# EAGLE design H01 (EAGLE 6.6.0)

## Sheet 1 of 3
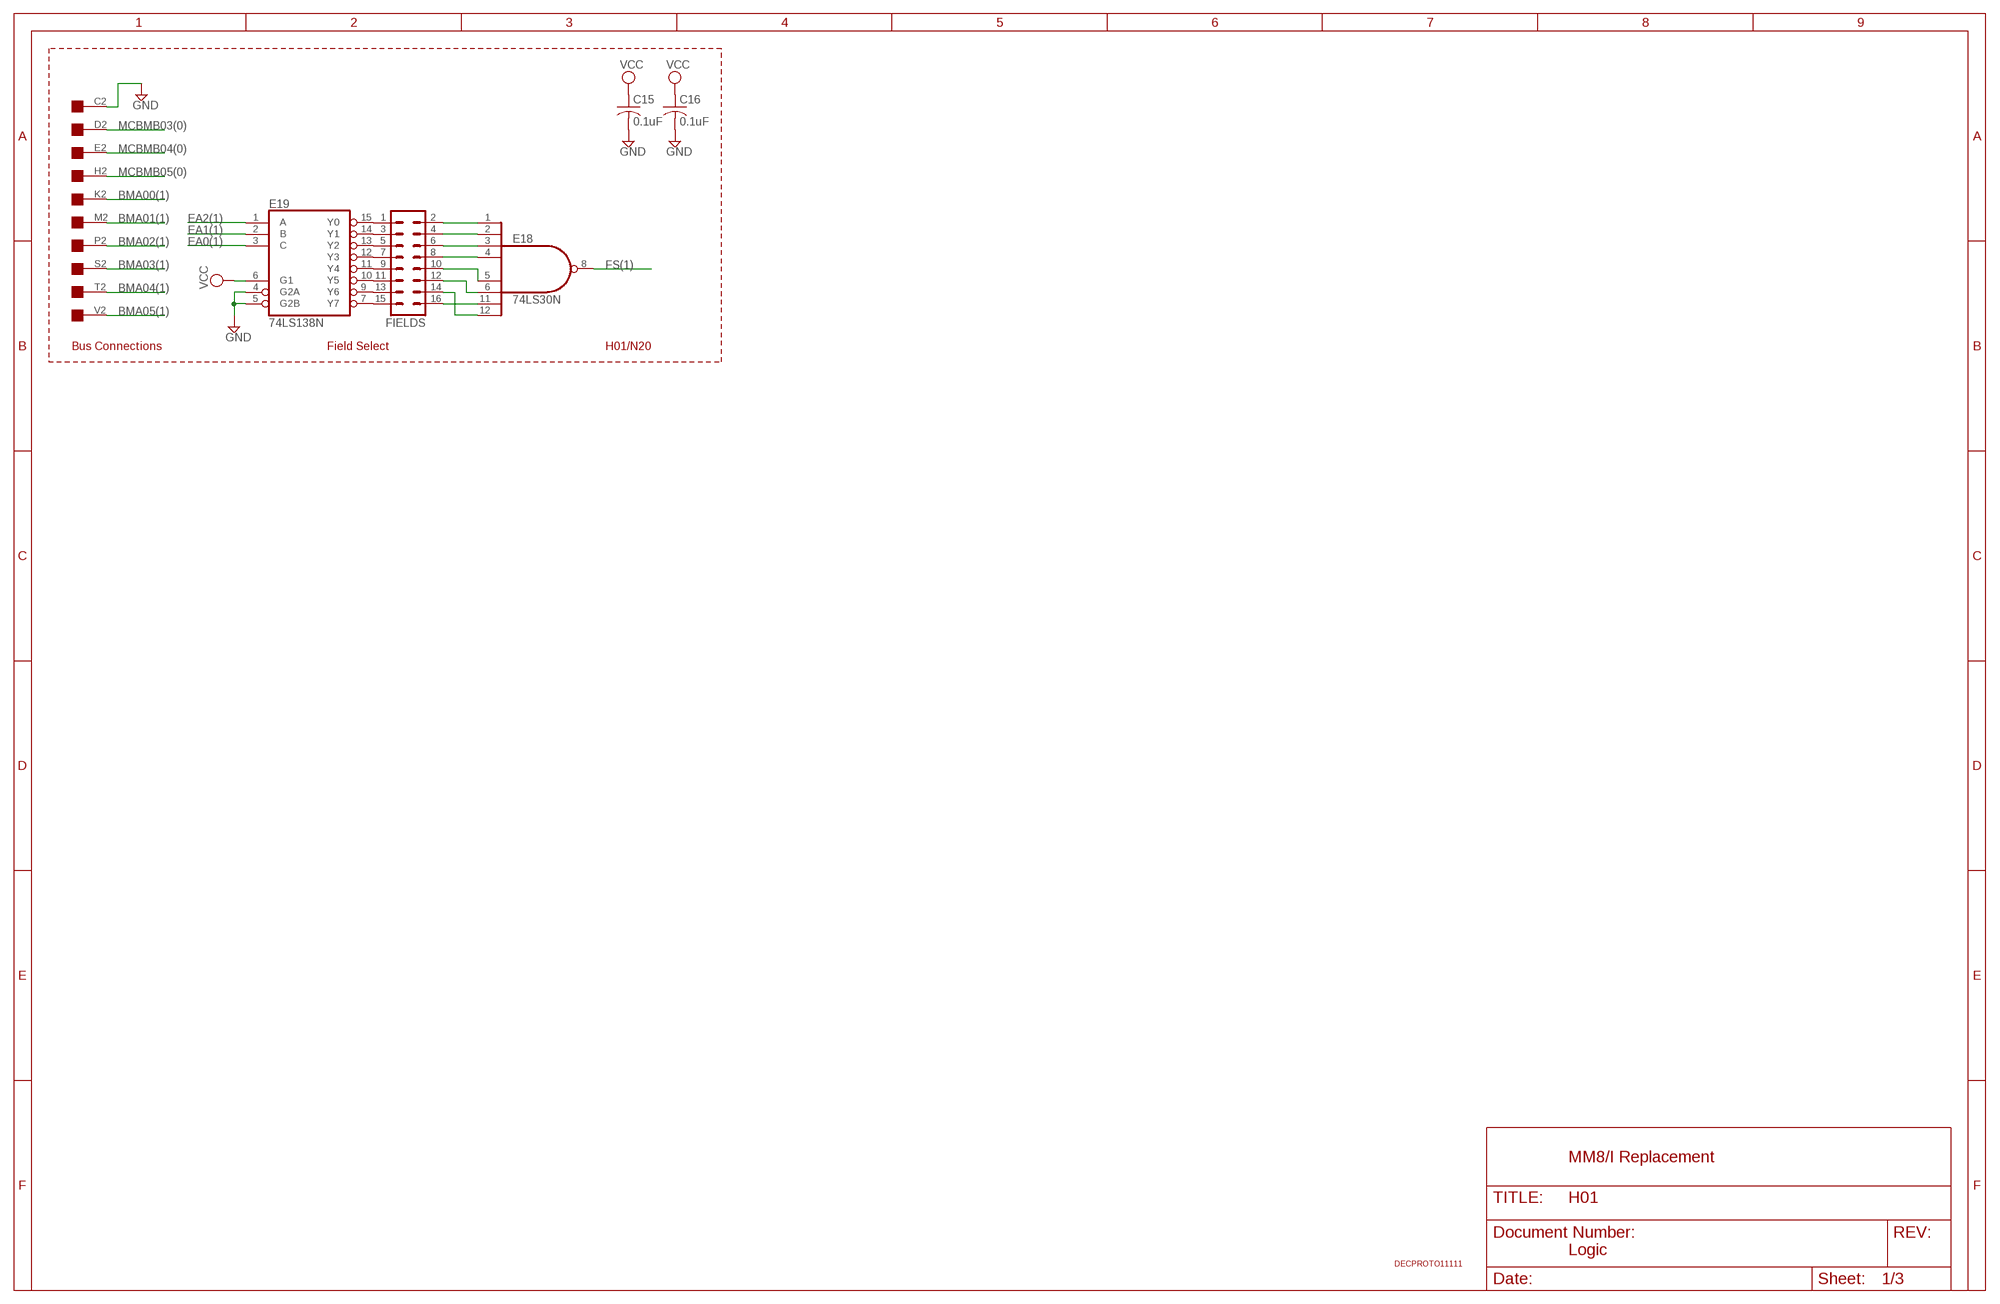
[diagram p0: schematic, sheet 1]

### Parts
C15  0.1uF  C-US050-025X075  [C050-025X075]
C16  0.1uF  C-US050-025X075  [C050-025X075]
E18  74LS30N  [DIL14]
E19  74LS138N  [DIL16]
FIELDS  MA08-2  [MA08-2]
H01  EDGE-1  [EDGE-CON1]
U$6  DECPROTO11111  [DECPROTO11111]

### Nets
BMA00(1): H01.K2 ; also sheet 2
BMA01(1): H01.M2 ; also sheet 2
BMA02(1): H01.P2 ; also sheet 2
BMA03(1): H01.S2 ; also sheet 2
BMA04(1): H01.T2 ; also sheet 2
BMA05(1): H01.V2 ; also sheet 2
EA0(1): E19.3(C) ; also sheet 2
EA1(1): E19.2(B) ; also sheet 2
EA2(1): E19.1(A) ; also sheet 2
FS(1): E18.8(O) ; also sheet 2
GND [supply]: C15.2 C16.2 E19.4(G2A) E19.5(G2B) H01.C2 ; also sheet 2
MCBMB03(0): H01.D2 ; also sheet 2
MCBMB04(0): H01.E2 ; also sheet 2
MCBMB05(0): H01.H2 ; also sheet 2
N$18: E19.15(Y0) FIELDS.1
N$19: E19.14(Y1) FIELDS.3
N$20: E19.13(Y2) FIELDS.5
N$21: E19.12(Y3) FIELDS.7
N$22: E19.11(Y4) FIELDS.9
N$23: E19.10(Y5) FIELDS.11
N$24: E19.9(Y6) FIELDS.13
N$25: E19.7(Y7) FIELDS.15
N$26: E18.4(I3) FIELDS.8
N$27: E18.3(I2) FIELDS.6
N$28: E18.2(I1) FIELDS.4
N$29: E18.1(I0) FIELDS.2
N$30: E18.5(I4) FIELDS.10
N$31: E18.6(I5) FIELDS.12
N$32: E18.12(I7) FIELDS.14
N$33: E18.11(I6) FIELDS.16
VCC [supply]: C15.1 C16.1 E19.6(G1) ; also sheet 2
Unconnected: H01.A2 H01.B2 H01.F2 H01.J2 H01.L2 H01.N2 H01.R2 H01.U2

### Notes on the sheet
- Bus Connections | Field Select | H01/N20
- MM8/I Replacement
- Logic

## Sheet 2 of 3
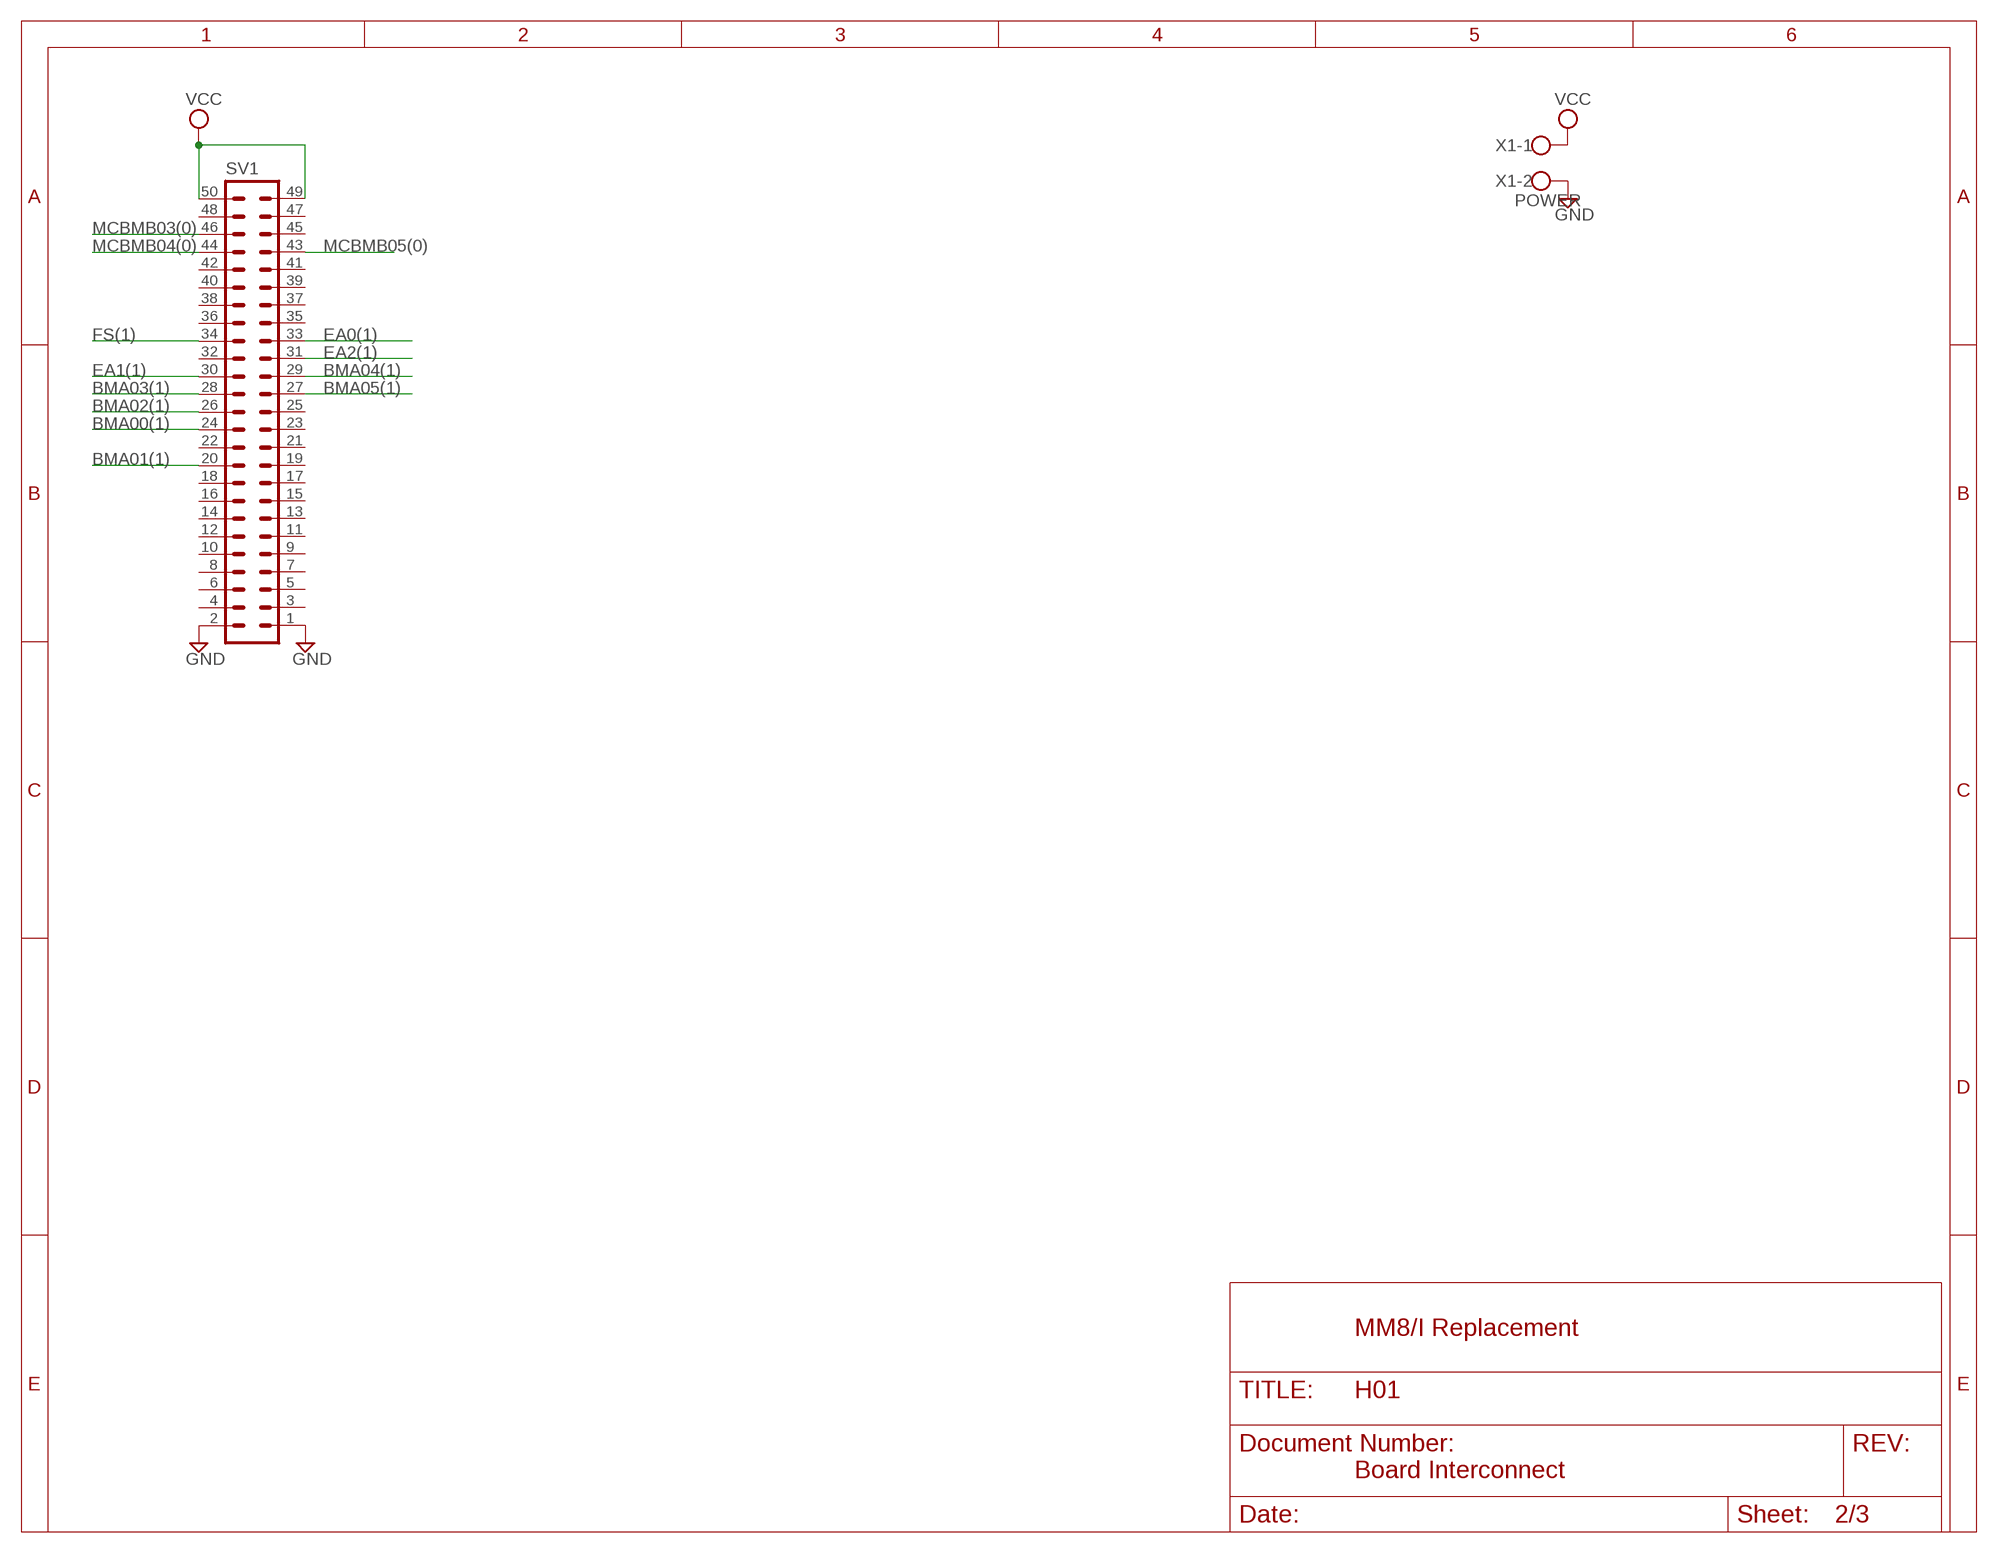
[diagram p1: schematic, sheet 2]

### Parts
SV1  ML50L  [ML50L]
X1  POWER  W237-102  [W237-102]

### Nets
BMA00(1): SV1.24 ; also sheet 1
BMA01(1): SV1.20 ; also sheet 1
BMA02(1): SV1.26 ; also sheet 1
BMA03(1): SV1.28 ; also sheet 1
BMA04(1): SV1.29 ; also sheet 1
BMA05(1): SV1.27 ; also sheet 1
EA0(1): SV1.33 ; also sheet 1
EA1(1): SV1.30 ; also sheet 1
EA2(1): SV1.31 ; also sheet 1
FS(1): SV1.34 ; also sheet 1
GND [supply]: SV1.1 SV1.2 X1.2 ; also sheet 1
MCBMB03(0): SV1.46 ; also sheet 1
MCBMB04(0): SV1.44 ; also sheet 1
MCBMB05(0): SV1.43 ; also sheet 1
VCC [supply]: SV1.49 SV1.50 X1.1 ; also sheet 1
Unconnected: SV1.3 SV1.4 SV1.5 SV1.6 SV1.7 SV1.8 SV1.9 SV1.10 SV1.11 SV1.12 SV1.13 SV1.14 SV1.15 SV1.16 SV1.17 SV1.18 SV1.19 SV1.21 SV1.22 SV1.23 SV1.25 SV1.32 SV1.35 SV1.36 SV1.37 SV1.38 SV1.39 SV1.40 SV1.41 SV1.42 SV1.45 SV1.47 SV1.48

### Notes on the sheet
- MM8/I Replacement
- Board Interconnect

## Sheet 3 of 3
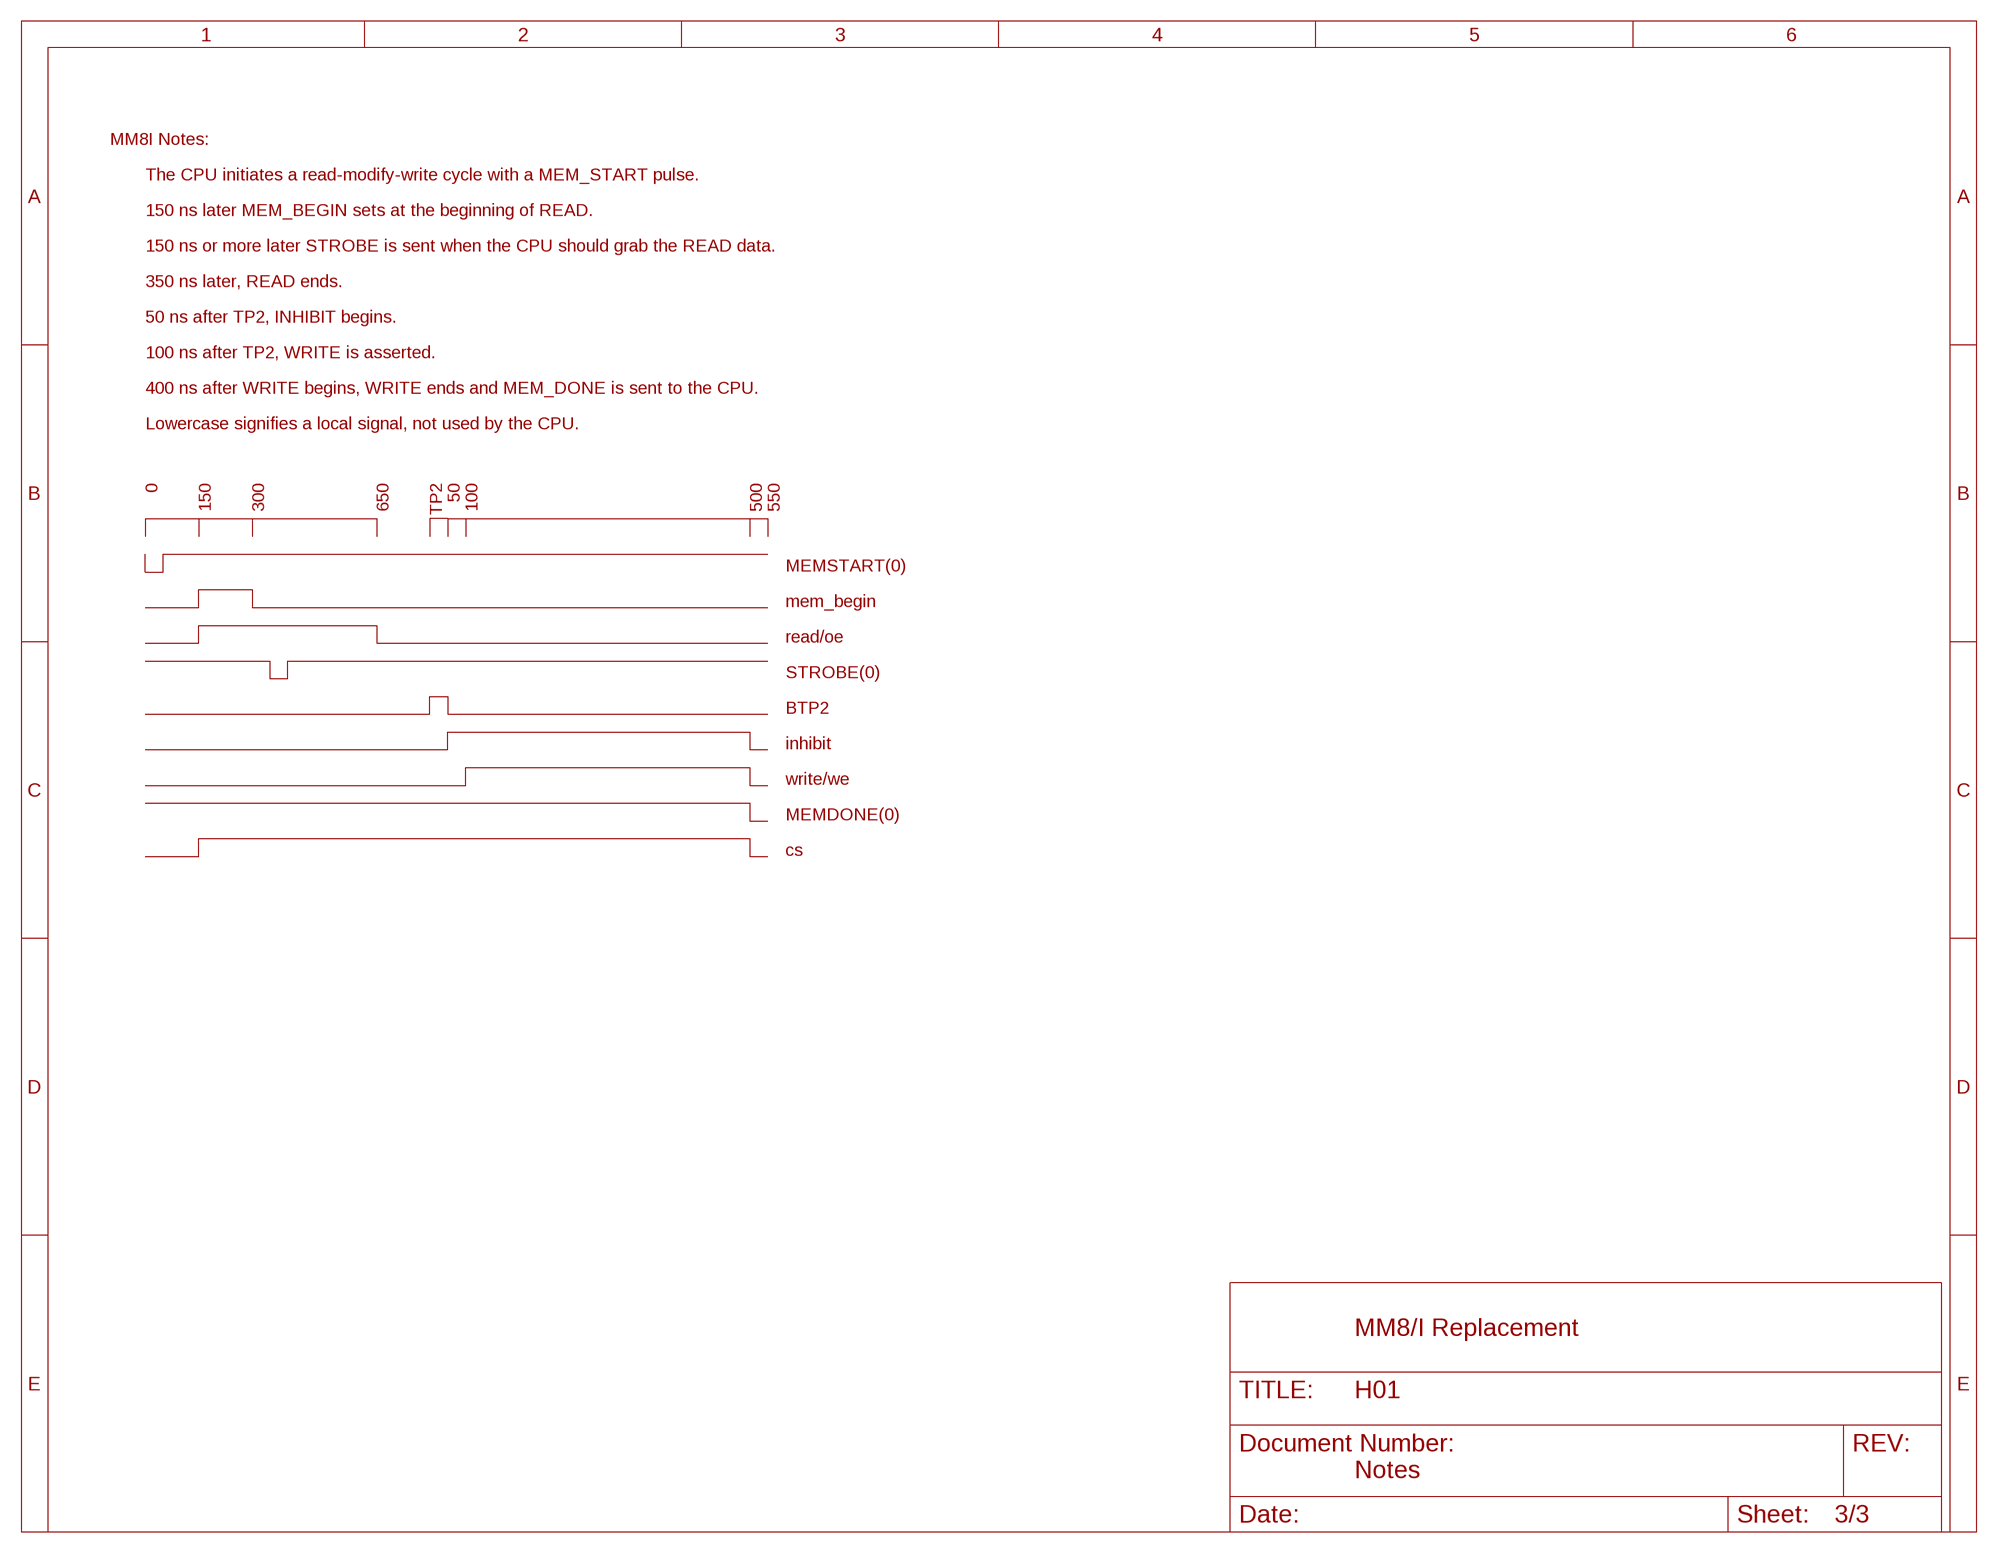
[diagram p2: schematic, sheet 3]

### Notes on the sheet
- MM8I Notes:
- The CPU initiates a read-modify-write cycle with a MEM_START pulse.
- 150 ns later MEM_BEGIN sets at the beginning of READ.
- 150 ns or more later STROBE is sent when the CPU should grab the READ data.
- 350 ns later, READ ends.
- 50 ns after TP2, INHIBIT begins.
- 100 ns after TP2, WRITE is asserted.
- 400 ns after WRITE begins, WRITE ends and MEM_DONE is sent to the CPU.
- Lowercase signifies a local signal, not used by the CPU.
- 0 | 150 | 300 | 650 | TP2 | 50 | 100 | 500 | 550
- MEMSTART(0)
- mem_begin
- read/oe
- STROBE(0)
- BTP2
- inhibit
- write/we
- MEMDONE(0)
- cs
- MM8/I Replacement
- Notes

## Power pins joined to a net without a drawn wire
GND: E18.7(GND) E19.8(GND)
VCC: E18.14(VCC) E19.16(VCC)

## Library data of the parts
C15 C16 = rcl:C-US: CAPACITOR, American symbol
E18 = 74xx-us:74*30: 8-input NAND gate
E19 = 74xx-us:74*138: 3-line to 8-line DECODER/DEMULTIPLEXER
FIELDS = con-lstb:MA08-2: PIN HEADER; OC_FARNELL: unknown; OC_NEWARK: unknown
H01 = dec-con:EDGE-1: Single-Sided DEC Edge Connector -- (side 2)
SV1 = con-ml:ML50L: HARTING; OC_FARNELL: unknown; OC_NEWARK: unknown
U$6 = dec-con:DECPROTO: Various small DEC boards stuck together with break-away tab routing.
X1 = con-wago-500:W237-102: WAGO SCREW CLAMP; MPN: 237-102; OC_FARNELL: unknown; OC_NEWARK: 70K9898

## Net classes
1 supply: width 0.711 mm

## Board
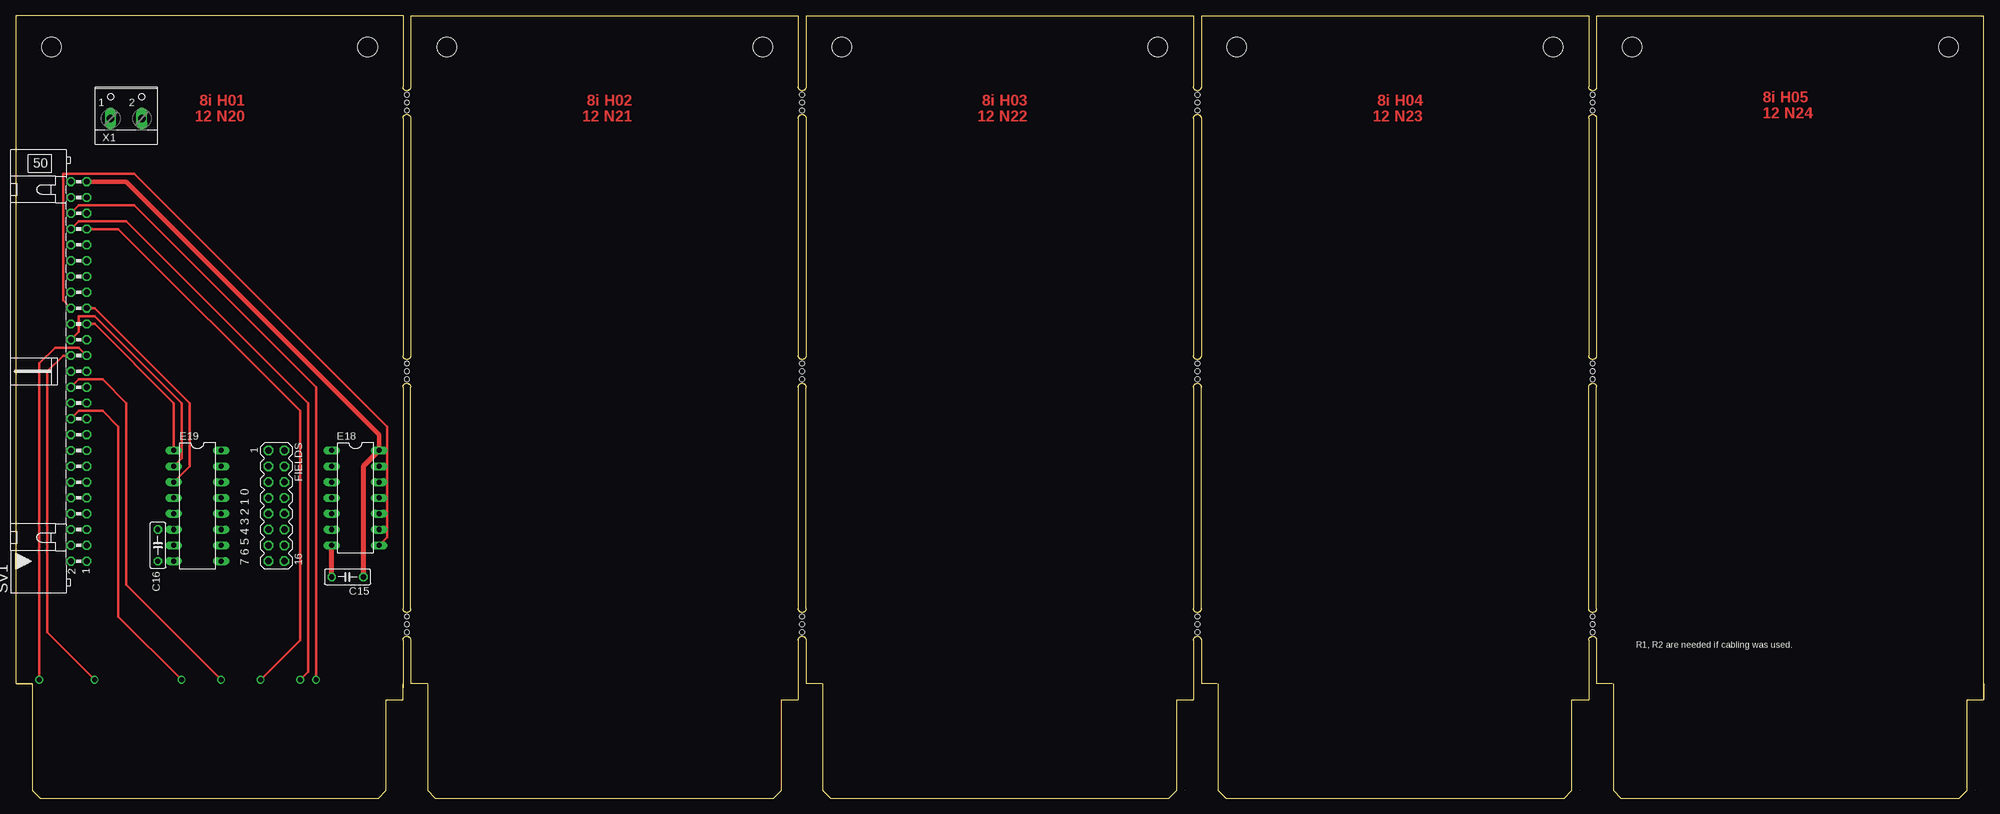
[diagram p3: board, top side]
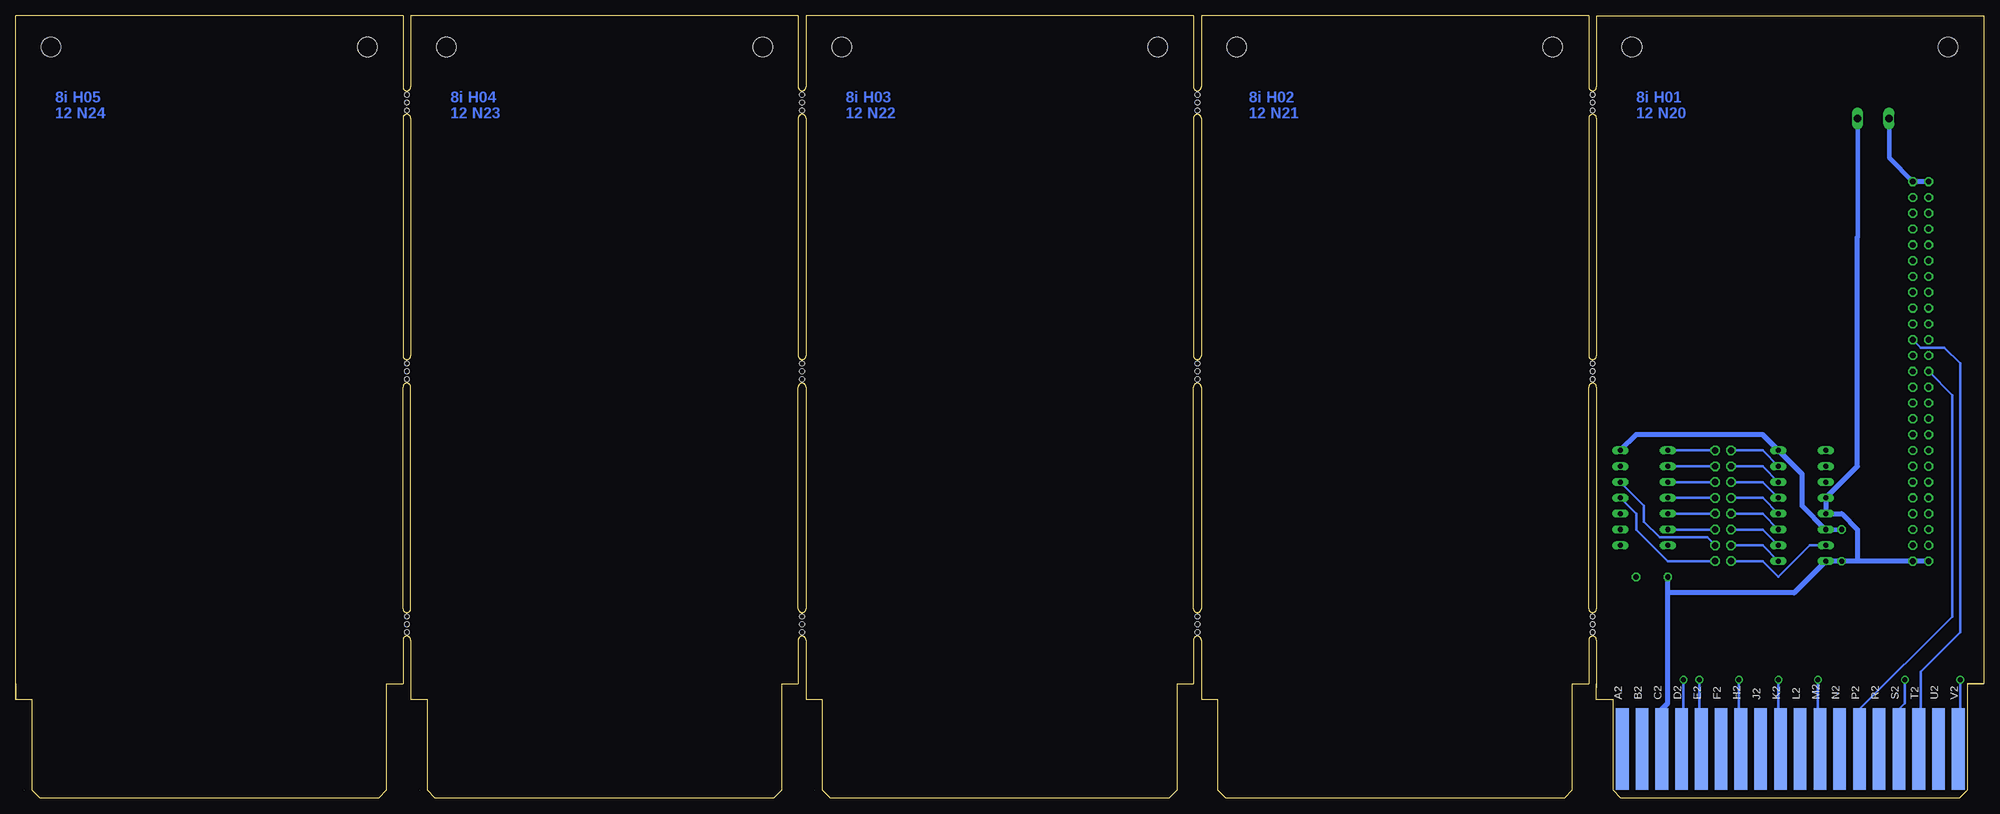
[diagram p4: board, bottom side, seen from below]

Size 316.23 x 125.73 mm. Coordinates in mm from the lower left corner, seen from the top.
Copper layers (1+16): Top 0.035mm / dielectric 1.5mm / Bottom 0.035mm
Design rules "16mils": minimum track width 16mil, minimum drill 32mil, track to track 15mil, track to pad 10mil, pad to pad 10mil, via to via 10mil, smd to smd 10mil, copper to edge 13mil, drill to drill 10mil, minimum pad ring 10mil, minimum via ring 8mil, stop-mask expansion 0mil, vias tented up to drill 0mil, thermal gap 10mil

### Footprints (pad centres in the part's own frame; a part is rotated, then mirrored left to right if it is on the bottom)
C050-025X075 = drill 0.813 octagon: 1 -2.54,0; 2 2.54,0
DIL14 = drill 0.813 long: 1 -7.62,-3.81; 2 -5.08,-3.81; 3 -2.54,-3.81; 4 0,-3.81; 5 2.54,-3.81; 6 5.08,-3.81; 7 7.62,-3.81; 8 7.62,3.81; 9 5.08,3.81; 10 2.54,3.81; 11 0,3.81; 12 -2.54,3.81; 13 -5.08,3.81; 14 -7.62,3.81
DIL16 = drill 0.813 long: 1 -8.89,-3.81; 2 -6.35,-3.81; 3 -3.81,-3.81; 4 -1.27,-3.81; 5 1.27,-3.81; 6 3.81,-3.81; 7 6.35,-3.81; 8 8.89,-3.81; 9 8.89,3.81; 10 6.35,3.81; 11 3.81,3.81; 12 1.27,3.81; 13 -1.27,3.81; 14 -3.81,3.81; 15 -6.35,3.81; 16 -8.89,3.81
MA08-2 = drill 1.016 octagon: 1 -8.89,-1.27; 2 -8.89,1.27; 3 -6.35,-1.27; 4 -6.35,1.27; 5 -3.81,-1.27; 6 -3.81,1.27; 7 -1.27,-1.27; 8 -1.27,1.27; 9 1.27,-1.27; 10 1.27,1.27; 11 3.81,-1.27; 12 3.81,1.27; 13 6.35,-1.27; 14 6.35,1.27; 15 8.89,-1.27; 16 8.89,1.27
EDGE-CON1 = smd 13.106 x 2.032 bottom: A2 7.938,4.128; B2 7.938,7.303; C2 7.938,10.477; D2 7.938,13.652; E2 7.938,16.828; F2 7.938,20.003; H2 7.938,23.177; J2 7.938,26.352; K2 7.938,29.527; L2 7.938,32.703; M2 7.938,35.877; N2 7.938,39.053; P2 7.938,42.227; R2 7.938,45.403; S2 7.938,48.578; T2 7.938,51.752; U2 7.938,54.928; V2 7.938,58.102
ML50L = drill 0.914 octagon: 1 -30.48,-1.27; 2 -30.48,1.27; 3 -27.94,-1.27; 4 -27.94,1.27; 5 -25.4,-1.27; 6 -25.4,1.27; 7 -22.86,-1.27; 8 -22.86,1.27; 9 -20.32,-1.27; 10 -20.32,1.27; 11 -17.78,-1.27; 12 -17.78,1.27; 13 -15.24,-1.27; 14 -15.24,1.27; 15 -12.7,-1.27; 16 -12.7,1.27; 17 -10.16,-1.27; 18 -10.16,1.27; 19 -7.62,-1.27; 20 -7.62,1.27; 21 -5.08,-1.27; 22 -5.08,1.27; 23 -2.54,-1.27; 24 -2.54,1.27; 25 0,-1.27; 26 0,1.27; 27 2.54,-1.27; 28 2.54,1.27; 29 5.08,-1.27; 30 5.08,1.27; 31 7.62,-1.27; 32 7.62,1.27; 33 10.16,-1.27; 34 10.16,1.27; 35 12.7,-1.27; 36 12.7,1.27; 37 15.24,-1.27; 38 15.24,1.27; 39 17.78,-1.27; 40 17.78,1.27; 41 20.32,-1.27; 42 20.32,1.27; 43 22.86,-1.27; 44 22.86,1.27; 45 25.4,-1.27; 46 25.4,1.27; 47 27.94,-1.27; 48 27.94,1.27; 49 30.48,-1.27; 50 30.48,1.27
DECPROTO11111 = hole 3.175: 183.515,120.65; 132.715,120.65; 69.266,120.65; 120.066,120.65; 56.566,120.65; 5.766,120.65; 247.015,120.65; 196.215,120.65; 310.515,120.65; 259.715,120.65 | hole 0.813: 62.865,69.85; 62.865,68.58; 62.865,67.31; 62.865,26.67; 62.865,27.94; 62.865,29.21; 62.865,113.03; 62.865,110.49; 62.865,111.76; 126.365,69.85; 126.365,68.58; 126.365,67.31; 126.365,26.67; 126.365,27.94; 126.365,29.21; 126.365,113.03; 126.365,110.49; 126.365,111.76; 189.865,26.67; 189.865,27.94; 189.865,29.21; 189.865,67.31; 189.865,68.58; 189.865,69.85; 189.865,110.49; 189.865,111.76; 189.865,113.03; 253.365,26.67; 253.365,27.94; 253.365,29.21; 253.365,67.31; 253.365,68.58; 253.365,69.85; 253.365,110.49; 253.365,111.76; 253.365,113.03
W237-102 = drill 1.194 long: 1 -2.5,-1.27; 2 2.5,-1.27

### Placement (x,y rotation side)
C15  53.34,35.56 180 top
C16  22.86,40.64 270 top
E18  54.61,48.26 270 top
E19  29.21,46.99 270 top
FIELDS  41.91,46.99 270 top
H01  62.23,0 90 top
SV1  10.16,68.58 90 top
U$6  0,0 0 top
X1  17.78,110.49 0 top

### Tracks (layer width: path | path; a pad name or v marks a point on that pad's centre or on a via)
BMA00(1)  (via drill 0.81)
  Top 0.406: SV1.24 10.16,67.31 13.97,67.31 17.78,63.5 17.78,34.29 v33.02,19.05
  Bottom 0.406: H01.K2 32.7,8.57 33.02,8.89 v33.02,19.05
BMA01(1)  (via drill 0.81)
  Top 0.406: SV1.20 10.16,62.23 13.97,62.23 16.51,59.69 16.51,29.21 v26.67,19.05
  Bottom 0.406: H01.M2 26.35,8.57 26.67,8.89 v26.67,19.05
BMA02(1)
  Bottom 0.406: H01.P2 20,8.57 20.32,8.89 20.32,13.97 5.08,29.21 5.08,64.77 SV1.26
BMA03(1)  (via drill 0.81)
  Top 0.406: SV1.28 7.62,71.12 5.08,68.58 5.08,26.67 v12.7,19.05
  Bottom 0.406: H01.S2 13.65,8.57 13.97,8.89 13.97,13.97 12.7,15.24 v12.7,19.05
BMA04(1)
  Bottom 0.406: H01.T2 10.48,8.57 10.16,8.89 10.16,20.32 3.81,26.67 3.81,69.85 6.35,72.39 10.16,72.39 SV1.29
BMA05(1)  (via drill 0.81)
  Top 0.406: SV1.27 10.16,72.39 6.35,72.39 3.81,69.85 v3.81,19.05
  Bottom 0.406: H01.V2 4.13,8.57 3.81,8.89 v3.81,19.05
EA0(1)
  Top 0.406: E19.3 27.94,53.34 27.94,63.5 12.7,78.74 SV1.33
EA1(1)
  Top 0.406: E19.2 26.67,54.61 26.67,63.5 12.7,77.47 10.16,77.47 10.16,74.93 SV1.30
EA2(1)
  Top 0.406: E19.1 25.4,63.5 12.7,76.2 SV1.31
FS(1)
  Top 0.406: SV1.34 7.62,80.01 7.62,100.33 19.05,100.33 59.69,59.69 59.69,41.91 E18.8
GND
  Top 0.813: C15.2 E18.7
  Bottom 0.711: 20.32,90.17 20.28,90.21 X1.2
  Bottom 0.813: H01.C2 51.75,8.57 52.07,8.89 52.07,13.97 50.8,15.24 50.8,33.02 | SV1.2 SV1.1 20.32,38.1 | 20.32,38.1 C16.2 E19.8 30.48,33.02 50.8,33.02 | 20.32,38.1 20.32,43.18 22.86,45.72 E19.5 E19.4 20.32,53.34 20.32,90.17 | 50.8,33.02 C15.2
MCBMB03(0)  (via drill 0.81)
  Top 0.406: v48.26,19.05 48.26,66.04 19.05,95.25 10.16,95.25 SV1.46
  Bottom 0.406: H01.D2 48.58,8.57 48.26,8.89 v48.26,19.05
MCBMB04(0)  (via drill 0.81)
  Top 0.406: v45.72,19.05 46.99,20.32 46.99,63.5 17.78,92.71 10.16,92.71 SV1.44
  Bottom 0.406: H01.E2 45.72,7.62 v45.72,19.05
MCBMB05(0)  (via drill 0.81)
  Top 0.406: SV1.43 16.51,91.44 45.72,62.23 45.72,25.4 v39.37,19.05
  Bottom 0.406: H01.H2 39.37,8.26 v39.37,19.05
N$18
  Bottom 0.406: E19.15 35.56,55.88 FIELDS.1
N$19
  Bottom 0.406: E19.14 35.56,53.34 FIELDS.3
N$20
  Bottom 0.406: E19.13 35.56,50.8 FIELDS.5
N$21
  Bottom 0.406: E19.12 35.56,48.26 FIELDS.7
N$22
  Bottom 0.406: E19.11 35.56,45.72 FIELDS.9
N$23
  Bottom 0.406: E19.10 35.56,43.18 FIELDS.11
N$24
  Bottom 0.406: E19.9 35.56,40.64 FIELDS.13
N$25
  Bottom 0.406: FIELDS.15 35.56,38.1 33.02,35.56 27.94,40.64 E19.7
N$26
  Bottom 0.406: FIELDS.8 E18.4
N$27
  Bottom 0.406: FIELDS.6 E18.3
N$28
  Bottom 0.406: E18.2 FIELDS.4
N$29
  Bottom 0.406: FIELDS.2 E18.1
N$30
  Bottom 0.406: FIELDS.10 E18.5
N$31
  Bottom 0.406: FIELDS.12 E18.6
N$32
  Bottom 0.406: FIELDS.14 44.45,41.91 52.07,41.91 54.61,44.45 54.61,46.99 E18.12
N$33
  Bottom 0.406: E18.11 55.88,45.72 55.88,43.18 50.8,38.1 FIELDS.16
VCC
  Top 0.711: SV1.49 17.78,99.06 58.42,58.42 E18.14
  Top 0.813: E18.14 55.88,53.34 C15.1
  Bottom 0.711: E19.6 C16.1 | SV1.49 15.24,102.87 15.24,109.22 X1.1
  Bottom 0.813: E19.6 29.21,46.99 29.21,52.07 E19.16 35.56,58.42 55.88,58.42 E18.14 | SV1.50 SV1.49

### Text on the board
Top: 8i H01 | 8i H02 | 8i H03 | 8i H04 | 8i H05 | 12 N20 | 12 N21 | 12 N22 | 12 N23 | 12 N24
Bottom: 8i H01 | 8i H02 | 8i H03 | 8i H04 | 8i H05 | 12 N20 | 12 N21 | 12 N22 | 12 N23 | 12 N24
tPlace: 7 6 5 4 3 2 1 0 | R1, R2 are needed if cabling was used.
tValues: 8i H01 | 8i H02 | 8i H03 | 8i H04 | 8i H05 | 12 N20 | 12 N21 | 12 N22 | 12 N23 | 12 N24 | VCC | GND